# EAGLE design LumaFix64+Vic85to65 (EAGLE 9.6.2)
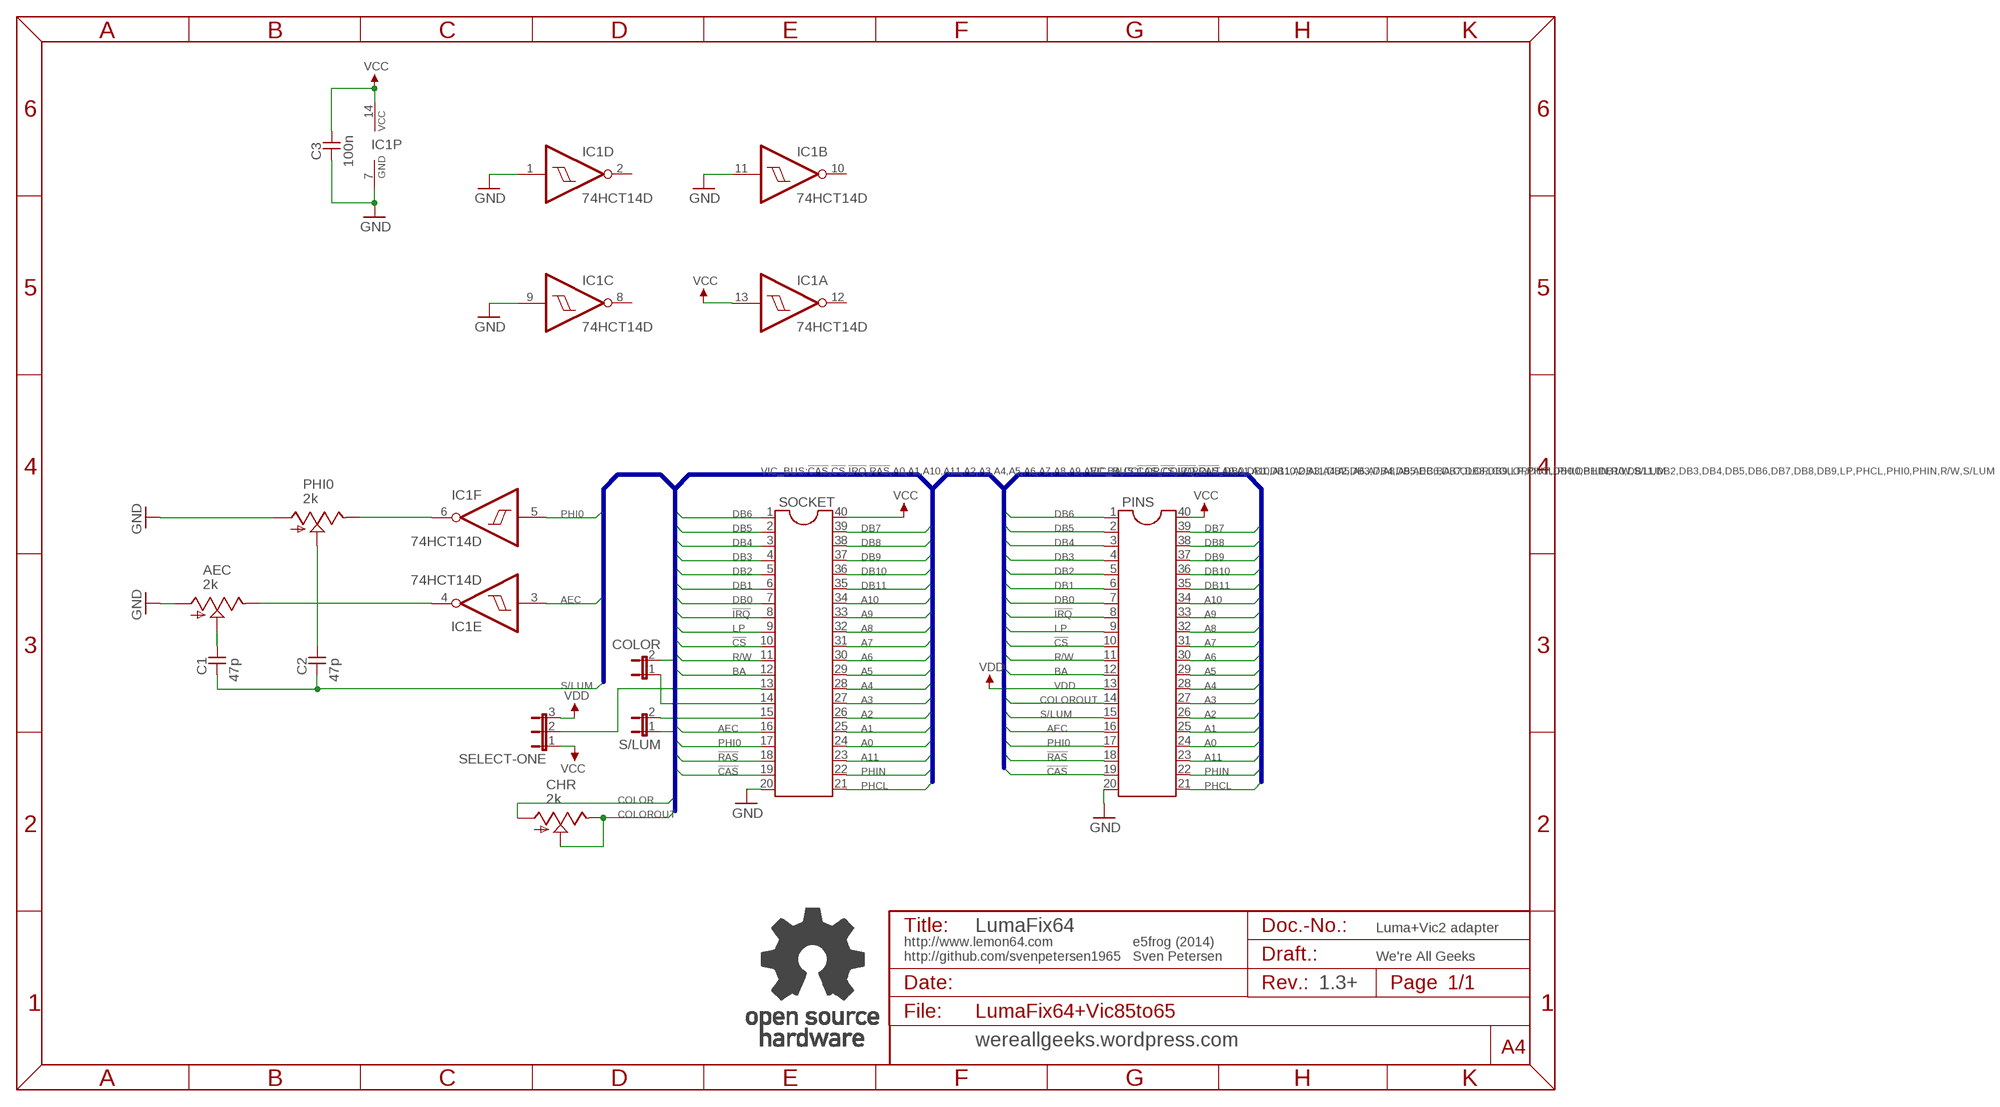
[diagram p0: schematic, sheet 1]

## Parts
AEC  2k  TRIM_US-RJ9W  [RJ9W]
C1  47p  C-0805  [0805]
C2  47p  C-0805  [0805]
C3  100n  C-0805  [0805]
CHR  2k  TRIM_US-RJ9W  [RJ9W]
COLOR  JP1E  [JP1]
IC1  74HCT14D  [SO14]
PHI0  2k  TRIM_US-RJ9W  [RJ9W]
PINS  IC-PACKAGE_DIL40_10120540  [BLK_10120540_2X20]
S/LUM  JP1E  [JP1]
SELECT-ONE  JP2E  [JP2]
SOCKET  IC-PACKAGE_DIL40GS40P  [GS40P]
U$13  OPEN_SOURCE_HW  [OPENHW]

## Nets
!CAS: PINS.19 SOCKET.19
!CS: PINS.10 SOCKET.10
!IRQ: PINS.8 SOCKET.8
!RAS: PINS.18 SOCKET.18
A0: PINS.24 SOCKET.24
A1: PINS.25 SOCKET.25
A2: PINS.26 SOCKET.26
A3: PINS.27 SOCKET.27
A4: PINS.28 SOCKET.28
A5: PINS.29 SOCKET.29
A6: PINS.30 SOCKET.30
A7: PINS.31 SOCKET.31
A8: PINS.32 SOCKET.32
A9: PINS.33 SOCKET.33
A10: PINS.34 SOCKET.34
A11: PINS.23 SOCKET.23
AEC: IC1.3(E:I) PINS.16 SOCKET.16
BA: PINS.12 SOCKET.12
COLOR: CHR.A COLOR.2
COLOROUT: CHR.E CHR.S PINS.14
DB0: PINS.7 SOCKET.7
DB1: PINS.6 SOCKET.6
DB2: PINS.5 SOCKET.5
DB3: PINS.4 SOCKET.4
DB4: PINS.3 SOCKET.3
DB5: PINS.2 SOCKET.2
DB6: PINS.1 SOCKET.1
DB7: PINS.39 SOCKET.39
DB8: PINS.38 SOCKET.38
DB9: PINS.37 SOCKET.37
DB10: PINS.36 SOCKET.36
DB11: PINS.35 SOCKET.35
GND: AEC.A C3.1 IC1.1(D:I) IC1.7(P:GND) IC1.9(C:I) IC1.11(B:I) PHI0.A PINS.20 SOCKET.20
LP: PINS.9 SOCKET.9
N$1: SELECT-ONE.2 SOCKET.13
N$2: COLOR.1 SOCKET.14
N$3: S/LUM.2 SOCKET.15
N$15: AEC.S C1.2
N$16: C2.2 PHI0.S
N$19: AEC.E IC1.4(E:O)
N$40: IC1.6(F:O) PHI0.E
PHCL: PINS.21 SOCKET.21
PHI0: IC1.5(F:I) PINS.17 SOCKET.17
PHIN: PINS.22 SOCKET.22
R/W: PINS.11 SOCKET.11
S/LUM: C1.1 C2.1 PINS.15 S/LUM.1
VCC: C3.2 IC1.13(A:I) IC1.14(P:VCC) PINS.40 SELECT-ONE.1 SOCKET.40
VDD: PINS.13 SELECT-ONE.3
Unconnected: IC1.2(D:O) IC1.8(C:O) IC1.10(B:O) IC1.12(A:O)

## Buses
VIC_BUS:!CAS,!CS,!IRQ,!RAS,A0,A1,A10,A11,A2,A3,A4,A5,A6,A7,A8,A9,AEC,BA,COLOR,COLOROUT,DB0,DB1,DB10,DB11,DB2,DB3,DB4,DB5,DB6,DB7,DB8,DB9,LP,PHCL,PHI0,PHIN,R/W,S/LUM

## Notes on the sheet
- LumaFix64 | Luma+Vic2 adapter
- http://www.lemon64.com
  http://github.com/svenpetersen1965
- e5frog (2014)
  Sven Petersen
- We're All Geeks
- 1.3+
- wereallgeeks.wordpress.com

## Library data of the parts
AEC CHR PHI0 = pot:TRIM_US-: POTENTIOMETER
C1-C3 = SMD:C-0805
COLOR S/LUM = jumper:JP1E: JUMPER
IC1 = 74xx-eu:74*14: Hex schmitt trigger INVERTER
PINS SOCKET = LumaFix64v1.0_B64W:IC-PACKAGE_DIL40: Dual In Line
SELECT-ONE = jumper:JP2E: JUMPER
U$13 = Logo:OPEN_SOURCE_HW

## Board
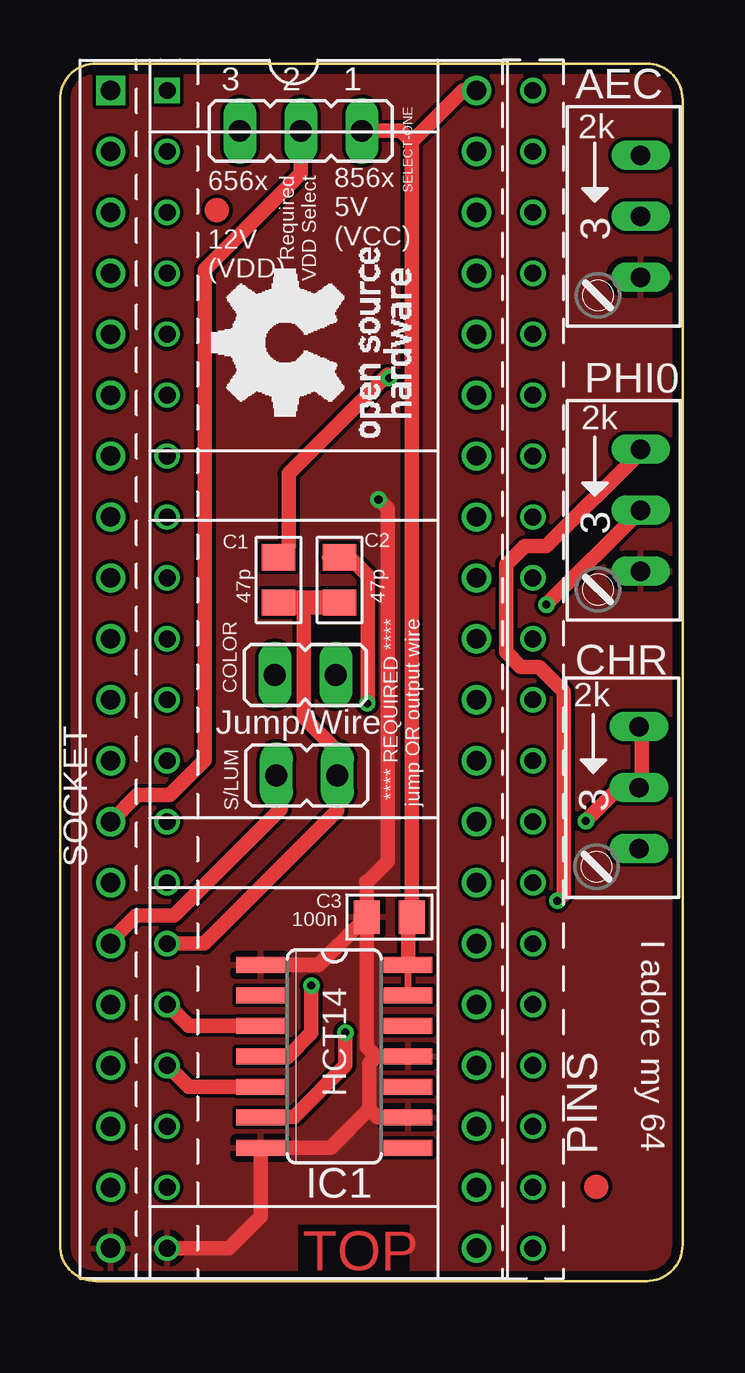
[diagram p1: board, top side]
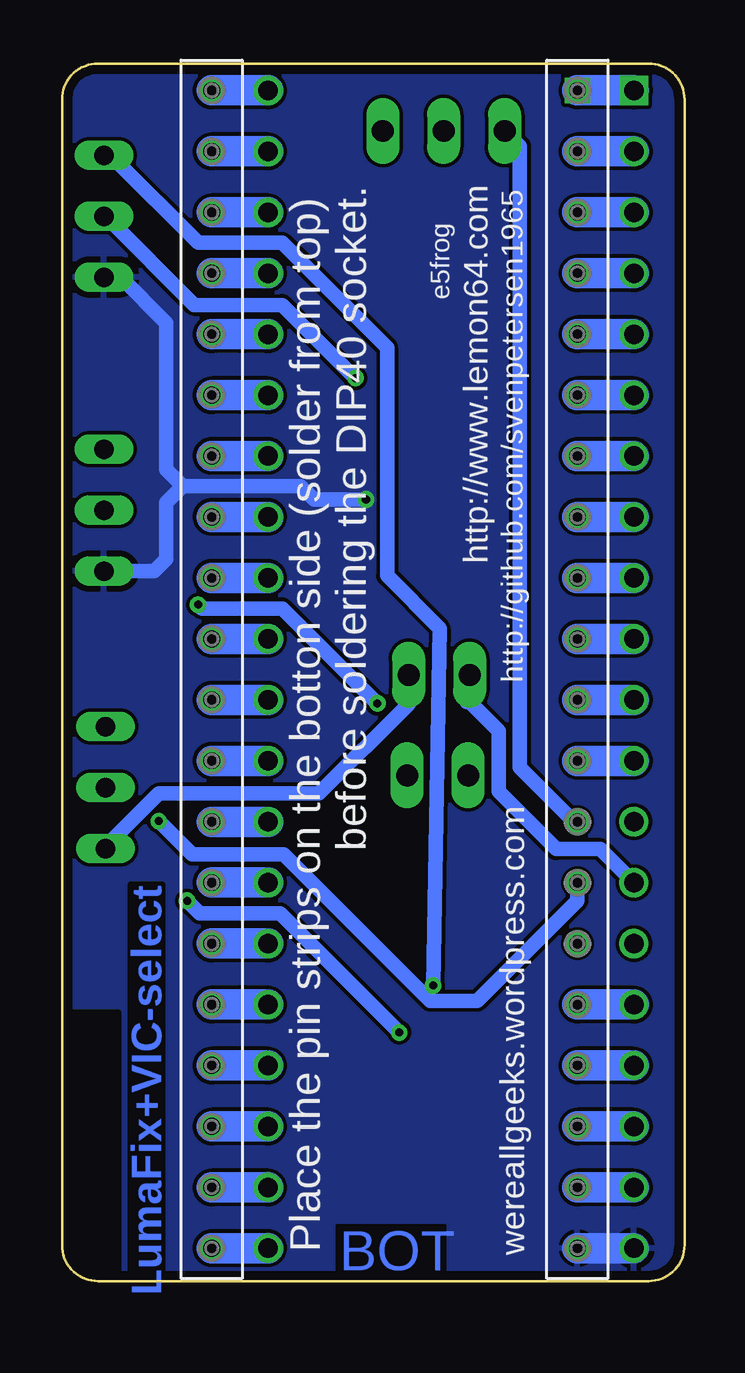
[diagram p2: board, bottom side, seen from below]

Size 25.94 x 50.75 mm. Coordinates in mm from the lower left corner, seen from the top.
Outline: 25.94,49.25 25.94,1.5 arc-90 24.44,0 1.5,0 arc-90 0,1.5 0,49.25 arc-90 1.5,50.75 24.44,50.75 arc-90 25.94,49.25
Copper layers (1*16): Top 0.0356mm / dielectric 1.5011mm / Bottom 0.0356mm
Design rules "oshpark *": minimum track width 6mil, minimum drill 13mil, track to track 6mil, track to pad 6mil, pad to pad 6mil, via to via 6mil, smd to smd 6mil, copper to edge 15mil, drill to drill 6mil, minimum pad ring 7mil, minimum via ring 7mil, stop-mask expansion 3mil, vias tented up to drill 0.6mm, thermal gap 10mil
bRestrict: 2 lines

### Footprints (pad centres in the part's own frame; a part is rotated, then mirrored left to right if it is on the bottom)
RJ9W = drill 0.813 long: A 2.54,0.635; E -2.54,0.635; S 0,0.635
0805 = smd 1.092 x 1.397: 1 -0.94,0; 2 0.94,0
JP1 = drill 0.914 long: 1 0,-1.27; 2 0,1.27
SO14 = smd 0.66 x 2.032: 1 -3.81,-3.073; 2 -2.54,-3.073; 3 -1.27,-3.073; 4 0,-3.073; 5 1.27,-3.073; 6 2.54,-3.073; 7 3.81,-3.073; 8 3.81,3.073; 9 2.54,3.073; 10 1.27,3.073; 11 0,3.073; 12 -1.27,3.073; 13 -2.54,3.073; 14 -3.81,3.073
BLK_10120540_2X20 = drill 0.7 square: 1 -24.13,-7.62 | drill 0.7: 2 -21.59,-7.62; 3 -19.05,-7.62; 4 -16.51,-7.62; 5 -13.97,-7.62; 6 -11.43,-7.62; 7 -8.89,-7.62; 8 -6.35,-7.62; 9 -3.81,-7.62; 10 -1.27,-7.62; 11 1.27,-7.62; 12 3.81,-7.62; 13 6.35,-7.62; 14 8.89,-7.62; 15 11.43,-7.62; 16 13.97,-7.62; 17 16.51,-7.62; 18 19.05,-7.62; 19 21.59,-7.62; 20 24.13,-7.62; 21 24.13,7.62; 22 21.59,7.62; 23 19.05,7.62; 24 16.51,7.62; 25 13.97,7.62; 26 11.43,7.62; 27 8.89,7.62; 28 6.35,7.62; 29 3.81,7.62; 30 1.27,7.62; 31 -1.27,7.62; 32 -3.81,7.62; 33 -6.35,7.62; 34 -8.89,7.62; 35 -11.43,7.62; 36 -13.97,7.62; 37 -16.51,7.62; 38 -19.05,7.62; 39 -21.59,7.62; 40 -24.13,7.62
JP2 = drill 0.914 long: 1 -2.54,0; 2 0,0; 3 2.54,0
GS40P = drill 0.813 square: 1 -24.13,-7.62 | drill 0.813: 2 -21.59,-7.62; 3 -19.05,-7.62; 4 -16.51,-7.62; 5 -13.97,-7.62; 6 -11.43,-7.62; 7 -8.89,-7.62; 8 -6.35,-7.62; 9 -3.81,-7.62; 10 -1.27,-7.62; 11 1.27,-7.62; 12 3.81,-7.62; 13 6.35,-7.62; 14 8.89,-7.62; 15 11.43,-7.62; 16 13.97,-7.62; 17 16.51,-7.62; 18 19.05,-7.62; 19 21.59,-7.62; 20 24.13,-7.62; 21 24.13,7.62; 22 21.59,7.62; 23 19.05,7.62; 24 16.51,7.62; 25 13.97,7.62; 26 11.43,7.62; 27 8.89,7.62; 28 6.35,7.62; 29 3.81,7.62; 30 1.27,7.62; 31 -1.27,7.62; 32 -3.81,7.62; 33 -6.35,7.62; 34 -8.89,7.62; 35 -11.43,7.62; 36 -13.97,7.62; 37 -16.51,7.62; 38 -19.05,7.62; 39 -21.59,7.62; 40 -24.13,7.62

### Placement (x,y rotation side)
AEC  23.56,44.39 270 top
C1  9.11,29.23 90 top
C2  11.65,29.23 90 top
C3  13.72,15.18 0 top
CHR  23.5,20.57 270 top
COLOR  10.22,25.27 270 top
IC1  11.43,9.37 270 top
PHI0  23.56,32.13 270 top
PINS  12.08,25.5 270 top
S/LUM  10.29,21.08 90 top
SELECT-ONE  10.03,47.94 180 top
SOCKET  9.73,25.5 270 top
U$7  [2LAYER]  10.1,0.44 0 top
U$9  [PCB-TITLE/]  0,53.91 0 top  (outside the outline)
U$10  [SMD_REF_R1MM]  22.35,3.94 0 top
U$11  [SMD_REF_R1MM]  6.54,44.64 0 top
U$13  14.61,35.18 90 top

### Tracks (layer width: path | path; a pad name or v marks a point on that pad's centre or on a via)
!CAS
  Bottom 1.27: SOCKET.19 PINS.19
!CS
  Bottom 1.27: SOCKET.10 PINS.10
!IRQ
  Bottom 1.27: SOCKET.8 PINS.8
!RAS
  Bottom 1.27: SOCKET.18 PINS.18
A0
  Bottom 1.27: SOCKET.24 PINS.24
A1
  Bottom 1.27: SOCKET.25 PINS.25
A2
  Bottom 1.27: SOCKET.26 PINS.26
A3
  Bottom 1.27: SOCKET.27 PINS.27
A4
  Bottom 1.27: SOCKET.28 PINS.28
A5
  Bottom 1.27: SOCKET.29 PINS.29
A6
  Bottom 1.27: SOCKET.30 PINS.30
A7
  Bottom 1.27: SOCKET.31 PINS.31
A8
  Bottom 1.27: SOCKET.32 PINS.32
A9
  Bottom 1.27: SOCKET.33 PINS.33
A10
  Bottom 1.27: SOCKET.34 PINS.34
A11
  Bottom 1.27: SOCKET.23 PINS.23
AEC
  Top 0.254: 4.45,11.56 PINS.16
  Top 0.61: IC1.3 5.37,10.64 4.45,11.56
  Bottom 1.27: SOCKET.16 PINS.16
BA
  Bottom 1.27: SOCKET.12 PINS.12
COLOR
  Bottom 0.152: 24.13,18.1 CHR.A
  Bottom 0.61: 24.13,18.1 21.91,20.32 15.24,20.32 11.49,24.07 COLOR.2
COLOROUT  (via drill 0.33)
  Top 0.152: 24.23,20.57 CHR.S 24.13,20.32
  Top 0.61: 24.23,20.57 24.23,23.01 CHR.E | v21.91,19.18 23.05,20.32 24.13,20.32
  Bottom 0.61: v21.91,19.18 20.51,17.78 16.7,17.78 10.6,11.68 8.63,11.68 4.46,15.85 PINS.14
DB0
  Bottom 1.27: SOCKET.7 PINS.7
DB1
  Bottom 1.27: SOCKET.6 PINS.6
DB2
  Bottom 1.27: SOCKET.5 PINS.5
DB3
  Bottom 1.27: SOCKET.4 PINS.4
DB4
  Bottom 1.27: SOCKET.3 PINS.3
DB5
  Bottom 1.27: SOCKET.2 PINS.2
DB6
  Bottom 1.27: SOCKET.1 PINS.1
DB7
  Bottom 1.27: SOCKET.39 PINS.39
DB8
  Bottom 1.27: SOCKET.38 PINS.38
DB9
  Bottom 1.27: SOCKET.37 PINS.37
DB10
  Bottom 1.27: SOCKET.36 PINS.36
DB11
  Bottom 1.27: SOCKET.35 PINS.35
GND  (via drill 0.35)
  Top 0.61: PINS.20 7.02,1.37 8.36,2.71 IC1.7 11.27,5.56 12.89,7.18 | IC1.9 13.24,6.83 12.89,7.18 | 12.89,7.18 12.89,9.08 13.18,9.37 | 13.18,9.37 IC1.11 | C3.1 12.78,16.62 | 12.78,16.62 12.76,16.64 | 12.78,16.62 13.65,17.5 13.65,32.19 v13.27,32.58 | C3.1 12.78,9.77 13.18,9.37 | IC1.1 10.78,13.18 C3.1
  Bottom 0.61: v13.27,32.58 15.43,32.58 16,33.15 20.91,33.15 | 20.91,33.15 21.59,33.83 21.59,39.94 23.5,41.85 | 20.91,33.15 21.59,32.46 21.59,30.1 22.1,29.59 PHI0.A
  Bottom 1.27: SOCKET.20 PINS.20
  pour Bottom: 25.93,49.4 25.93,1.5 arc-90 24.43,0 1.66,0 arc-90 0,1.5 0,49.4 arc-90 1.66,50.75 24.43,50.75 arc-90
  pour Top: 25.93,49.25 25.93,1.5 arc-90 24.43,0 1.66,0 arc-90 0,1.5 0,49.25 arc-90 1.5,50.75 24.43,50.75 arc-90
LP
  Bottom 1.27: SOCKET.9 PINS.9
N$1
  Top 0.61: SELECT-ONE.2 10.03,46.16 6.03,42.16 6.03,21.72 4.57,20.26 3.22,20.26 SOCKET.13
N$2
  Bottom 0.152: 8.95,24.13 9.08,24.13 | 9.08,25.15 COLOR.1
  Bottom 0.61: SOCKET.14 3.51,18.01 5.35,18.01 7.75,20.4 7.75,22.92 8.95,24.13 | 9.08,24.13 9.08,25.15
N$3
  Top 0.61: SOCKET.15 2.22,14.29 3.17,15.24 4.76,15.24 9.21,19.68 9.21,20.95 S/LUM.2
N$15  (via drill 0.33)
  Top 0.152: 9.53,30.62 C1.2 | 13.65,37.78 v13.72,37.64
  Top 0.61: 9.53,30.62 9.53,33.66 13.65,37.78
  Bottom 0.152: 24.08,44.35 AEC.S
  Bottom 0.61: v13.72,37.64 16.76,40.69 20.42,40.69 24.08,44.35
N$16  (via drill 0.33)
  Top 0.152: 12.8,27.32 v12.8,24.08 12.83,24.09 | PHI0.S | 12.07,30.16 C2.2
  Top 0.305: C2.2 11.04,30.17
  Top 0.61: PHI0.S v20.27,28.19 | 12.07,30.16 12.83,29.4 12.83,24.09
  Bottom 0.152: v20.27,28.19 20.12,28.04
  Bottom 0.61: v12.8,24.08 16.76,28.04 20.12,28.04
N$19  (via drill 0.33)
  Top 0.152: 8.23,9.45 IC1.4 8.39,9.34
  Top 0.61: 8.39,9.34 9.46,9.34 10.48,10.35 v10.48,12.32
  Bottom 0.152: 23.77,46.79 24.08,46.79 AEC.E
  Bottom 0.61: 23.77,46.79 20.27,43.28 16.76,43.28 12.39,38.91 12.39,29.4 10.21,27.21 v10.48,12.32
N$40  (via drill 0.33)
  Top 0.152: 8.38,6.86 IC1.6 | 24.23,34.59 PHI0.E
  Top 0.61: 8.38,6.86 9.75,6.86 11.89,8.99 v11.89,10.36 | v20.73,15.85 20.98,16.1 20.98,24.59 19.96,25.6 19.2,25.6 18.59,26.21 18.59,29.87 19.36,30.63 20.27,30.63 24.23,34.59
  Bottom 0.61: v11.89,10.36 16.85,15.33 20.21,15.33 v20.73,15.85
PHCL
  Bottom 1.27: SOCKET.21 PINS.21
PHI0
  Top 0.254: 4.45,9.02 PINS.17
  Top 0.61: IC1.5 5.37,8.1 4.45,9.02
  Bottom 0.254: 4.51,9.02 PINS.17
  Bottom 1.27: SOCKET.17 PINS.17
PHIN
  Bottom 1.27: SOCKET.22 PINS.22
R/W
  Bottom 1.27: SOCKET.11 PINS.11
S/LUM
  Top 0.152: PINS.15 | 11.43,21.27 S/LUM.1
  Top 0.61: S/LUM.1 11.56,19.62 6.01,14.08 PINS.15 | 11.43,21.27 11.43,22.23 10.16,23.5 10.16,28.23 C1.1
  Top 1.016: C2.1 C1.1
VCC
  Top 0.3: 13.81,13.18 IC1.14 IC1.13
  Top 0.61: IC1.14 14.5,15.02 C3.2 14.66,47.48 | SOCKET.40 16.8,49.63 14.66,47.48 | SELECT-ONE.1 14.2,47.94 14.66,47.48
  Bottom 1.27: SOCKET.40 PINS.40
VDD
  Bottom 0.61: SELECT-ONE.3 6.86,47.31 6.86,21.42 4.59,19.15 PINS.13

### Text on the board
Bottom: LumaFix+VIC-select
tPlace: 2k | 656x / / 12V / (VDD) | Required / VDD Select | 856x / 5V / (VCC) | 2k | 47p | **** REQUIRED **** / jump OR output wire | 47p | 2k | SOCKET | 100n | I adore my 64 | HCT14
bPlace: Place the pin strips on the botton side (solder from top) / before soldering the DIP40 socket. | e5frog | http://www.lemon64.com | http://github.com/svenpetersen1965
tNames: Jump/Wire
bNames: wereallgeeks.wordpress.com
tStop: We're All Geeks
Document: LumaFix64+Vic855to65 | Luma+Vic2 adapter | e5frog http://www.lemon64.com / Sven Petersen | 35µm | 2 | /wereallgeeks | 1.3+